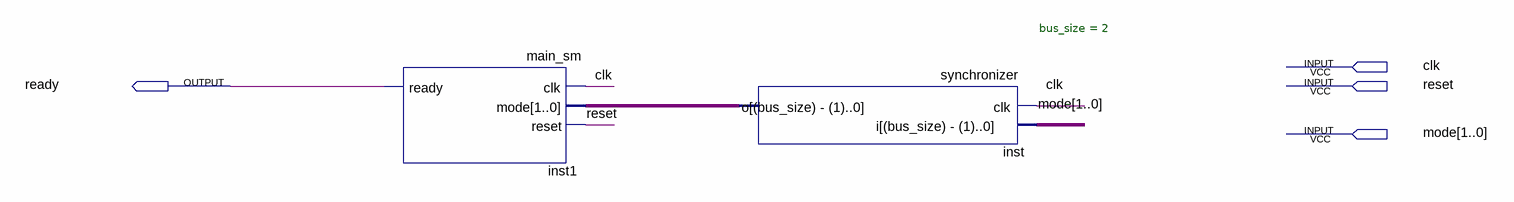
[diagram p0: schematic sheet]
// Quartus schematic SensorBuchas_CPLD.bdf as structural Verilog: 2 symbols, 4 pins
module SensorBuchas_CPLD (
  input  clk,
  input  reset,
  input  [1:0] mode,
  output ready
);

  wire [1:0] inst_o;

  main_sm inst1 (.clk(clk), .mode(inst_o), .reset(reset), .ready(ready));
  synchronizer #(.bus_size(2)) inst (.clk(clk), .i(mode), .o(inst_o));
endmodule
